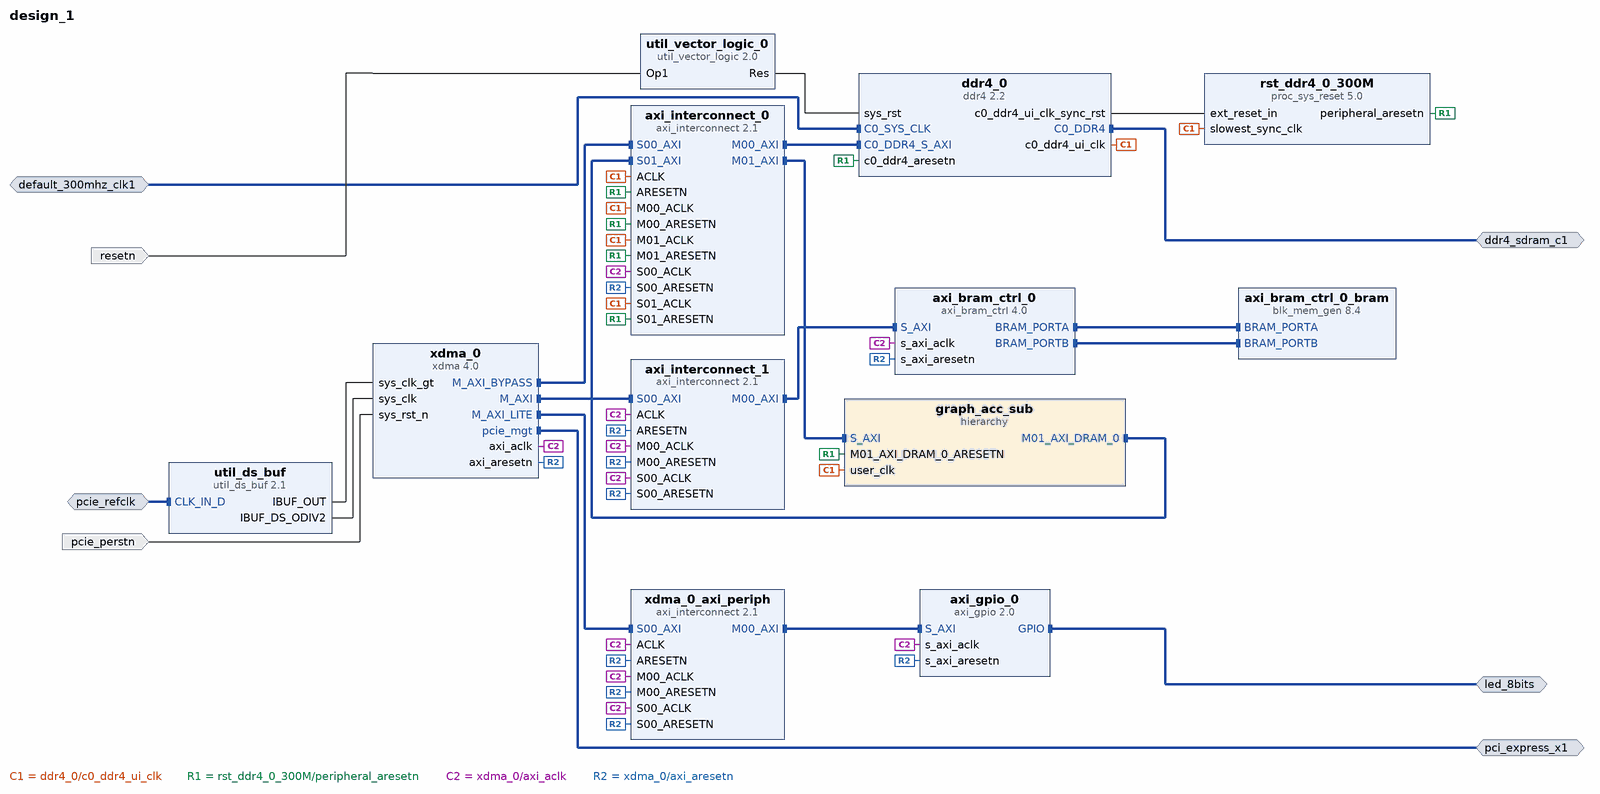
[diagram p0: block diagram of the top level]
# Vivado block design design_1, xcku115-flvb2104-2-e, Vivado 2017.4
create_bd_design design_1

create_bd_intf_port -mode Master -vlnv xilinx.com:interface:ddr4_rtl:1.0 ddr4_sdram_c1
create_bd_intf_port -mode Slave -vlnv xilinx.com:interface:diff_clock_rtl:1.0 default_300mhz_clk1
set_property -dict {CONFIG.FREQ_HZ 300000000} [get_bd_intf_ports default_300mhz_clk1]
create_bd_intf_port -mode Master -vlnv xilinx.com:interface:pcie_7x_mgt_rtl:1.0 pci_express_x1
create_bd_intf_port -mode Slave -vlnv xilinx.com:interface:diff_clock_rtl:1.0 pcie_refclk
set_property -dict {CONFIG.FREQ_HZ 100000000} [get_bd_intf_ports pcie_refclk]
create_bd_intf_port -mode Master -vlnv xilinx.com:interface:gpio_rtl:1.0 led_8bits
create_bd_port -dir I -type rst pcie_perstn
set_property -dict {CONFIG.POLARITY ACTIVE_LOW} [get_bd_ports pcie_perstn]
create_bd_port -dir I -type rst resetn
set_property -dict {CONFIG.POLARITY ACTIVE_LOW} [get_bd_ports resetn]

create_bd_cell -type ip -vlnv xilinx.com:ip:ddr4:2.2 ddr4_0
set_property -dict [list \
  CONFIG.RESET_BOARD_INTERFACE resetn \
  CONFIG.C0_CLOCK_BOARD_INTERFACE default_300mhz_clk1 \
  CONFIG.C0_DDR4_BOARD_INTERFACE ddr4_sdram_c1 \
] [get_bd_cells ddr4_0]
create_bd_cell -type ip -vlnv xilinx.com:ip:xdma:4.0 xdma_0
set_property -dict [list \
  CONFIG.axi_data_width 256_bit \
  CONFIG.axisten_freq 250 \
  CONFIG.pf0_device_id 8038 \
  CONFIG.pf0_base_class_menu Memory_controller \
  CONFIG.pf0_class_code_base 05 \
  CONFIG.pf0_sub_class_interface_menu Other_memory_controller \
  CONFIG.pf0_class_code_sub 80 \
  CONFIG.pf0_class_code_interface 00 \
  CONFIG.axilite_master_en true \
  CONFIG.axilite_master_size 4 \
  CONFIG.axilite_master_scale Kilobytes \
  CONFIG.axist_bypass_en true \
  CONFIG.axist_bypass_size 512 \
  CONFIG.axist_bypass_scale Megabytes \
  CONFIG.pciebar2axibar_axil_master 0x0000000040000000 \
  CONFIG.xdma_rnum_chnl 1 \
  CONFIG.SYS_RST_N_BOARD_INTERFACE pcie_perstn \
  CONFIG.PCIE_BOARD_INTERFACE pci_express_x8 \
  CONFIG.xdma_axi_intf_mm AXI_Memory_Mapped \
  CONFIG.xdma_pcie_64bit_en false \
  CONFIG.dsc_bypass_rd 0000 \
  CONFIG.xdma_sts_ports false \
  CONFIG.cfg_mgmt_if false \
  CONFIG.axi_bypass_64bit_en true \
  CONFIG.axi_bypass_prefetchable true \
  CONFIG.PF0_DEVICE_ID_mqdma 9038 \
  CONFIG.PF2_DEVICE_ID_mqdma 9038 \
  CONFIG.PF3_DEVICE_ID_mqdma 9038 \
] [get_bd_cells xdma_0]
create_bd_cell -type ip -vlnv xilinx.com:ip:util_ds_buf:2.1 util_ds_buf
set_property -dict {CONFIG.USE_BOARD_FLOW true CONFIG.DIFF_CLK_IN_BOARD_INTERFACE pcie_refclk} [get_bd_cells util_ds_buf]
create_bd_cell -type ip -vlnv xilinx.com:ip:proc_sys_reset:5.0 rst_ddr4_0_300M
create_bd_cell -type ip -vlnv xilinx.com:ip:util_vector_logic:2.0 util_vector_logic_0
set_property -dict {CONFIG.C_SIZE 1 CONFIG.C_OPERATION not} [get_bd_cells util_vector_logic_0]
create_bd_cell -type ip -vlnv xilinx.com:ip:axi_gpio:2.0 axi_gpio_0
set_property -dict {CONFIG.USE_BOARD_FLOW true CONFIG.GPIO_BOARD_INTERFACE led_8bits} [get_bd_cells axi_gpio_0]
create_bd_cell -type ip -vlnv xilinx.com:ip:axi_bram_ctrl:4.0 axi_bram_ctrl_0
create_bd_cell -type ip -vlnv xilinx.com:ip:axi_interconnect:2.1 xdma_0_axi_periph
set_property -dict {CONFIG.NUM_MI 1} [get_bd_cells xdma_0_axi_periph]
create_bd_cell -type ip -vlnv xilinx.com:ip:blk_mem_gen:8.4 axi_bram_ctrl_0_bram
set_property -dict {CONFIG.Memory_Type True_Dual_Port_RAM} [get_bd_cells axi_bram_ctrl_0_bram]
create_bd_cell -type ip -vlnv xilinx.com:ip:axi_interconnect:2.1 axi_interconnect_0
set_property -dict {CONFIG.NUM_SI 2 CONFIG.NUM_MI 2} [get_bd_cells axi_interconnect_0]
create_bd_cell -type ip -vlnv xilinx.com:ip:axi_interconnect:2.1 axi_interconnect_1
set_property -dict {CONFIG.NUM_MI 1} [get_bd_cells axi_interconnect_1]
create_bd_cell -type hier graph_acc_sub

# ---- hierarchy /graph_acc_sub ----
current_bd_instance /graph_acc_sub
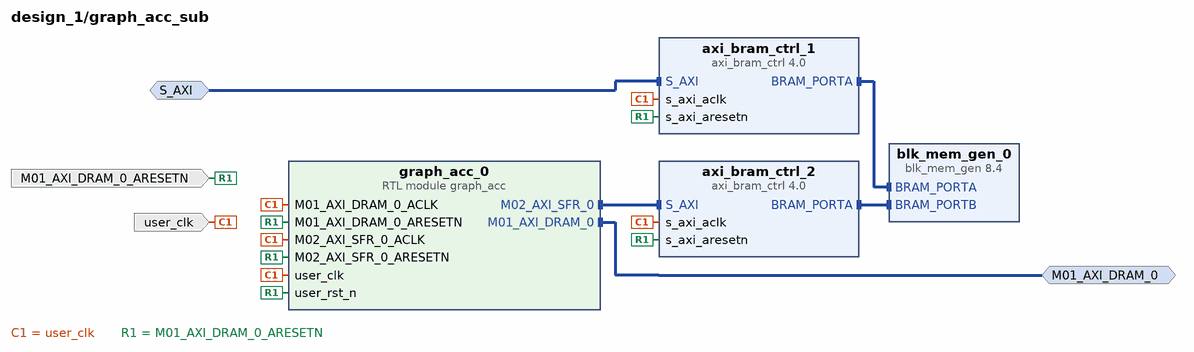
[diagram p1: block diagram inside /graph_acc_sub]
create_bd_intf_pin -mode Master -vlnv xilinx.com:interface:aximm_rtl:1.0 M01_AXI_DRAM_0
create_bd_intf_pin -mode Slave -vlnv xilinx.com:interface:aximm_rtl:1.0 S_AXI
create_bd_pin -dir I -type clk user_clk
create_bd_pin -dir I -type rst M01_AXI_DRAM_0_ARESETN

create_bd_cell -type ip -vlnv xilinx.com:ip:axi_bram_ctrl:4.0 axi_bram_ctrl_2
set_property -dict {CONFIG.DATA_WIDTH 512 CONFIG.SINGLE_PORT_BRAM 1} [get_bd_cells axi_bram_ctrl_2]
create_bd_cell -type ip -vlnv xilinx.com:ip:blk_mem_gen:8.4 blk_mem_gen_0
set_property -dict [list \
  CONFIG.Memory_Type True_Dual_Port_RAM \
  CONFIG.Enable_B Use_ENB_Pin \
  CONFIG.Use_RSTB_Pin true \
  CONFIG.Port_B_Clock 100 \
  CONFIG.Port_B_Write_Rate 50 \
  CONFIG.Port_B_Enable_Rate 100 \
] [get_bd_cells blk_mem_gen_0]
create_bd_cell -type ip -vlnv xilinx.com:ip:axi_bram_ctrl:4.0 axi_bram_ctrl_1
set_property -dict {CONFIG.DATA_WIDTH 512 CONFIG.SINGLE_PORT_BRAM 1} [get_bd_cells axi_bram_ctrl_1]
create_bd_cell -type module -reference graph_acc graph_acc_0

# ---- connections ----

current_bd_instance /graph_acc_sub
connect_bd_intf_net [get_bd_intf_pins graph_acc_0/M02_AXI_SFR_0] [get_bd_intf_pins axi_bram_ctrl_2/S_AXI]
connect_bd_intf_net [get_bd_intf_pins axi_bram_ctrl_2/BRAM_PORTA] [get_bd_intf_pins blk_mem_gen_0/BRAM_PORTB]
connect_bd_intf_net [get_bd_intf_pins axi_bram_ctrl_1/BRAM_PORTA] [get_bd_intf_pins blk_mem_gen_0/BRAM_PORTA]
connect_bd_intf_net [get_bd_intf_pins M01_AXI_DRAM_0] [get_bd_intf_pins graph_acc_0/M01_AXI_DRAM_0]
connect_bd_intf_net -intf_net axi_interconnect_0_M01_AXI [get_bd_intf_pins S_AXI] [get_bd_intf_pins axi_bram_ctrl_1/S_AXI]
connect_bd_net -net ddr4_0_c0_ddr4_ui_clk [get_bd_pins user_clk] \
  [get_bd_pins axi_bram_ctrl_1/s_axi_aclk] [get_bd_pins axi_bram_ctrl_2/s_axi_aclk] \
  [get_bd_pins graph_acc_0/M01_AXI_DRAM_0_ACLK] [get_bd_pins graph_acc_0/M02_AXI_SFR_0_ACLK] \
  [get_bd_pins graph_acc_0/user_clk]
connect_bd_net -net rst_ddr4_0_300M_peripheral_aresetn [get_bd_pins M01_AXI_DRAM_0_ARESETN] \
  [get_bd_pins axi_bram_ctrl_1/s_axi_aresetn] [get_bd_pins axi_bram_ctrl_2/s_axi_aresetn] \
  [get_bd_pins graph_acc_0/M01_AXI_DRAM_0_ARESETN] [get_bd_pins graph_acc_0/M02_AXI_SFR_0_ARESETN] \
  [get_bd_pins graph_acc_0/user_rst_n]

current_bd_instance /
connect_bd_intf_net [get_bd_intf_pins xdma_0/M_AXI_LITE] [get_bd_intf_pins xdma_0_axi_periph/S00_AXI]
connect_bd_intf_net [get_bd_intf_pins xdma_0_axi_periph/M00_AXI] [get_bd_intf_pins axi_gpio_0/S_AXI]
connect_bd_intf_net [get_bd_intf_pins axi_bram_ctrl_0_bram/BRAM_PORTA] [get_bd_intf_pins axi_bram_ctrl_0/BRAM_PORTA]
connect_bd_intf_net [get_bd_intf_pins axi_bram_ctrl_0_bram/BRAM_PORTB] [get_bd_intf_pins axi_bram_ctrl_0/BRAM_PORTB]
connect_bd_intf_net [get_bd_intf_pins xdma_0/M_AXI_BYPASS] [get_bd_intf_pins axi_interconnect_0/S00_AXI]
connect_bd_intf_net [get_bd_intf_pins axi_interconnect_0/M00_AXI] [get_bd_intf_pins ddr4_0/C0_DDR4_S_AXI]
connect_bd_intf_net [get_bd_intf_pins xdma_0/M_AXI] [get_bd_intf_pins axi_interconnect_1/S00_AXI]
connect_bd_intf_net [get_bd_intf_pins axi_bram_ctrl_0/S_AXI] [get_bd_intf_pins axi_interconnect_1/M00_AXI]
connect_bd_intf_net [get_bd_intf_pins axi_interconnect_0/M01_AXI] [get_bd_intf_pins graph_acc_sub/S_AXI]
connect_bd_intf_net -intf_net graph_acc_0_M01_AXI_DRAM_0 [get_bd_intf_pins graph_acc_sub/M01_AXI_DRAM_0] [get_bd_intf_pins axi_interconnect_0/S01_AXI]
connect_bd_intf_net [get_bd_intf_ports ddr4_sdram_c1] [get_bd_intf_pins ddr4_0/C0_DDR4]
connect_bd_intf_net -intf_net default_300mhz_clk1_1 [get_bd_intf_ports default_300mhz_clk1] [get_bd_intf_pins ddr4_0/C0_SYS_CLK]
connect_bd_intf_net [get_bd_intf_ports pci_express_x1] [get_bd_intf_pins xdma_0/pcie_mgt]
connect_bd_intf_net [get_bd_intf_ports pcie_refclk] [get_bd_intf_pins util_ds_buf/CLK_IN_D]
connect_bd_intf_net [get_bd_intf_ports led_8bits] [get_bd_intf_pins axi_gpio_0/GPIO]
connect_bd_net [get_bd_ports pcie_perstn] [get_bd_pins xdma_0/sys_rst_n]
connect_bd_net [get_bd_pins util_ds_buf/IBUF_OUT] [get_bd_pins xdma_0/sys_clk_gt]
connect_bd_net [get_bd_pins util_ds_buf/IBUF_DS_ODIV2] [get_bd_pins xdma_0/sys_clk]
connect_bd_net [get_bd_pins ddr4_0/c0_ddr4_ui_clk] \
  [get_bd_pins rst_ddr4_0_300M/slowest_sync_clk] [get_bd_pins axi_interconnect_0/ACLK] \
  [get_bd_pins axi_interconnect_0/M00_ACLK] [get_bd_pins graph_acc_sub/user_clk] [get_bd_pins axi_interconnect_0/S01_ACLK] \
  [get_bd_pins axi_interconnect_0/M01_ACLK]
connect_bd_net [get_bd_pins ddr4_0/c0_ddr4_ui_clk_sync_rst] [get_bd_pins rst_ddr4_0_300M/ext_reset_in]
connect_bd_net [get_bd_pins rst_ddr4_0_300M/peripheral_aresetn] \
  [get_bd_pins ddr4_0/c0_ddr4_aresetn] [get_bd_pins axi_interconnect_0/ARESETN] [get_bd_pins axi_interconnect_0/M00_ARESETN] \
  [get_bd_pins graph_acc_sub/M01_AXI_DRAM_0_ARESETN] [get_bd_pins axi_interconnect_0/M01_ARESETN] \
  [get_bd_pins axi_interconnect_0/S01_ARESETN]
connect_bd_net [get_bd_pins util_vector_logic_0/Res] [get_bd_pins ddr4_0/sys_rst]
connect_bd_net [get_bd_ports resetn] [get_bd_pins util_vector_logic_0/Op1]
connect_bd_net [get_bd_pins xdma_0/axi_aclk] \
  [get_bd_pins axi_gpio_0/s_axi_aclk] [get_bd_pins axi_bram_ctrl_0/s_axi_aclk] [get_bd_pins xdma_0_axi_periph/S00_ACLK] \
  [get_bd_pins xdma_0_axi_periph/M00_ACLK] [get_bd_pins xdma_0_axi_periph/ACLK] [get_bd_pins axi_interconnect_1/ACLK] \
  [get_bd_pins axi_interconnect_1/S00_ACLK] [get_bd_pins axi_interconnect_1/M00_ACLK] \
  [get_bd_pins axi_interconnect_0/S00_ACLK]
connect_bd_net [get_bd_pins xdma_0/axi_aresetn] \
  [get_bd_pins axi_gpio_0/s_axi_aresetn] [get_bd_pins axi_bram_ctrl_0/s_axi_aresetn] \
  [get_bd_pins xdma_0_axi_periph/S00_ARESETN] [get_bd_pins xdma_0_axi_periph/M00_ARESETN] \
  [get_bd_pins xdma_0_axi_periph/ARESETN] [get_bd_pins axi_interconnect_1/ARESETN] \
  [get_bd_pins axi_interconnect_1/S00_ARESETN] [get_bd_pins axi_interconnect_1/M00_ARESETN] \
  [get_bd_pins axi_interconnect_0/S00_ARESETN]

# ---- address map ----
assign_bd_address -offset 0x000000000 -range 256M -target_address_space [get_bd_addr_spaces graph_acc_sub/graph_acc_0/M01_AXI_DRAM_0] [get_bd_addr_segs ddr4_0/C0_DDR4_MEMORY_MAP/C0_DDR4_ADDRESS_BLOCK]
assign_bd_address -offset 0x010000000 -range 64K -target_address_space [get_bd_addr_spaces graph_acc_sub/graph_acc_0/M01_AXI_DRAM_0] [get_bd_addr_segs graph_acc_sub/axi_bram_ctrl_1/S_AXI/Mem0]
assign_bd_address -offset 0x010000000 -range 64K -target_address_space [get_bd_addr_spaces graph_acc_sub/graph_acc_0/M02_AXI_SFR_0] [get_bd_addr_segs graph_acc_sub/axi_bram_ctrl_2/S_AXI/Mem0]
assign_bd_address -offset 0x0000000100000000 -range 4K -target_address_space [get_bd_addr_spaces xdma_0/M_AXI] [get_bd_addr_segs axi_bram_ctrl_0/S_AXI/Mem0]
assign_bd_address -offset 0x0000000000000000 -range 256M -target_address_space [get_bd_addr_spaces xdma_0/M_AXI_BYPASS] [get_bd_addr_segs ddr4_0/C0_DDR4_MEMORY_MAP/C0_DDR4_ADDRESS_BLOCK]
assign_bd_address -offset 0x0000000010000000 -range 64K -target_address_space [get_bd_addr_spaces xdma_0/M_AXI_BYPASS] [get_bd_addr_segs graph_acc_sub/axi_bram_ctrl_1/S_AXI/Mem0]
assign_bd_address -offset 0x40000000 -range 4K -target_address_space [get_bd_addr_spaces xdma_0/M_AXI_LITE] [get_bd_addr_segs axi_gpio_0/S_AXI/Reg]

validate_bd_design
save_bd_design
